# EAGLE design wifistepper (EAGLE 7.6.0)
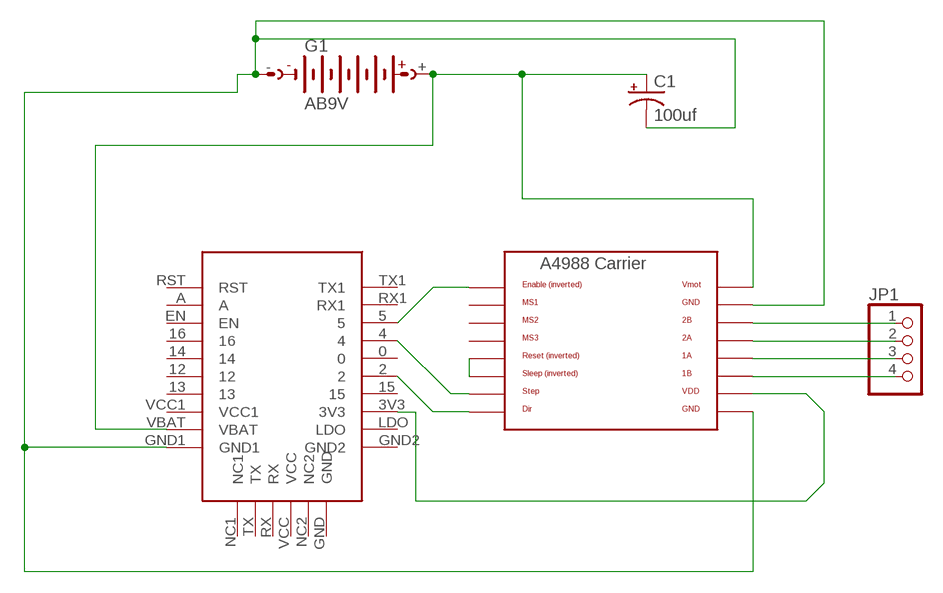
[diagram p0: schematic, sheet 1]

## Parts
C1  100uf  CPOL-USE2.5-6  [E2,5-6]
G1  AB9V  [AB9V]
JP1  PINHD-1X4  [1X04]
U$1  HUZZAH_BREAKOUT_ESP8266THROUGHHOLE  [HUZZAH_BREAKOUT]
U$2  A4988BREAKOUT  [A4988BREAKOUT]

## Nets
N$1: C1.+ G1.+ U$1.VBAT U$2.VMOT
N$2: JP1.1 U$2.2B
N$3: C1.- G1.- U$1.GND1 U$2.GND U$2.GND@0(GND)
N$4: JP1.2 U$2.2A
N$5: JP1.3 U$2.1A
N$6: JP1.4 U$2.1B
N$8: U$1.3V3 U$2.VDD
N$10: U$2.RST U$2.SLP(SLEEP)
N$11: U$1.5 U$2.EN
N$12: U$1.4 U$2.STEP
N$13: U$1.2 U$2.DIR
Unconnected: U$1.0 U$1.12 U$1.13 U$1.14 U$1.15 U$1.16 U$1.A U$1.EN U$1.GND U$1.GND2 U$1.LDO U$1.NC1 U$1.NC2 U$1.RST U$1.RX U$1.RX1 U$1.TX U$1.TX1 U$1.VCC U$1.VCC1 U$2.MS1 U$2.MS2 U$2.MS3

## Library data of the parts
C1 = adafruit:CPOL-US: POLARIZED CAPACITOR, American symbol
G1 = battery:AB9V: 9-V BATTERY CLIP
JP1 = pinhead:PINHD-1X4: PIN HEADER
U$1 = adafruit:HUZZAH_BREAKOUT_ESP8266: Adafruit HUZZAH ESP8266 Breakout Board
U$2 = RepRapjr:A4988BREAKOUT

## Board
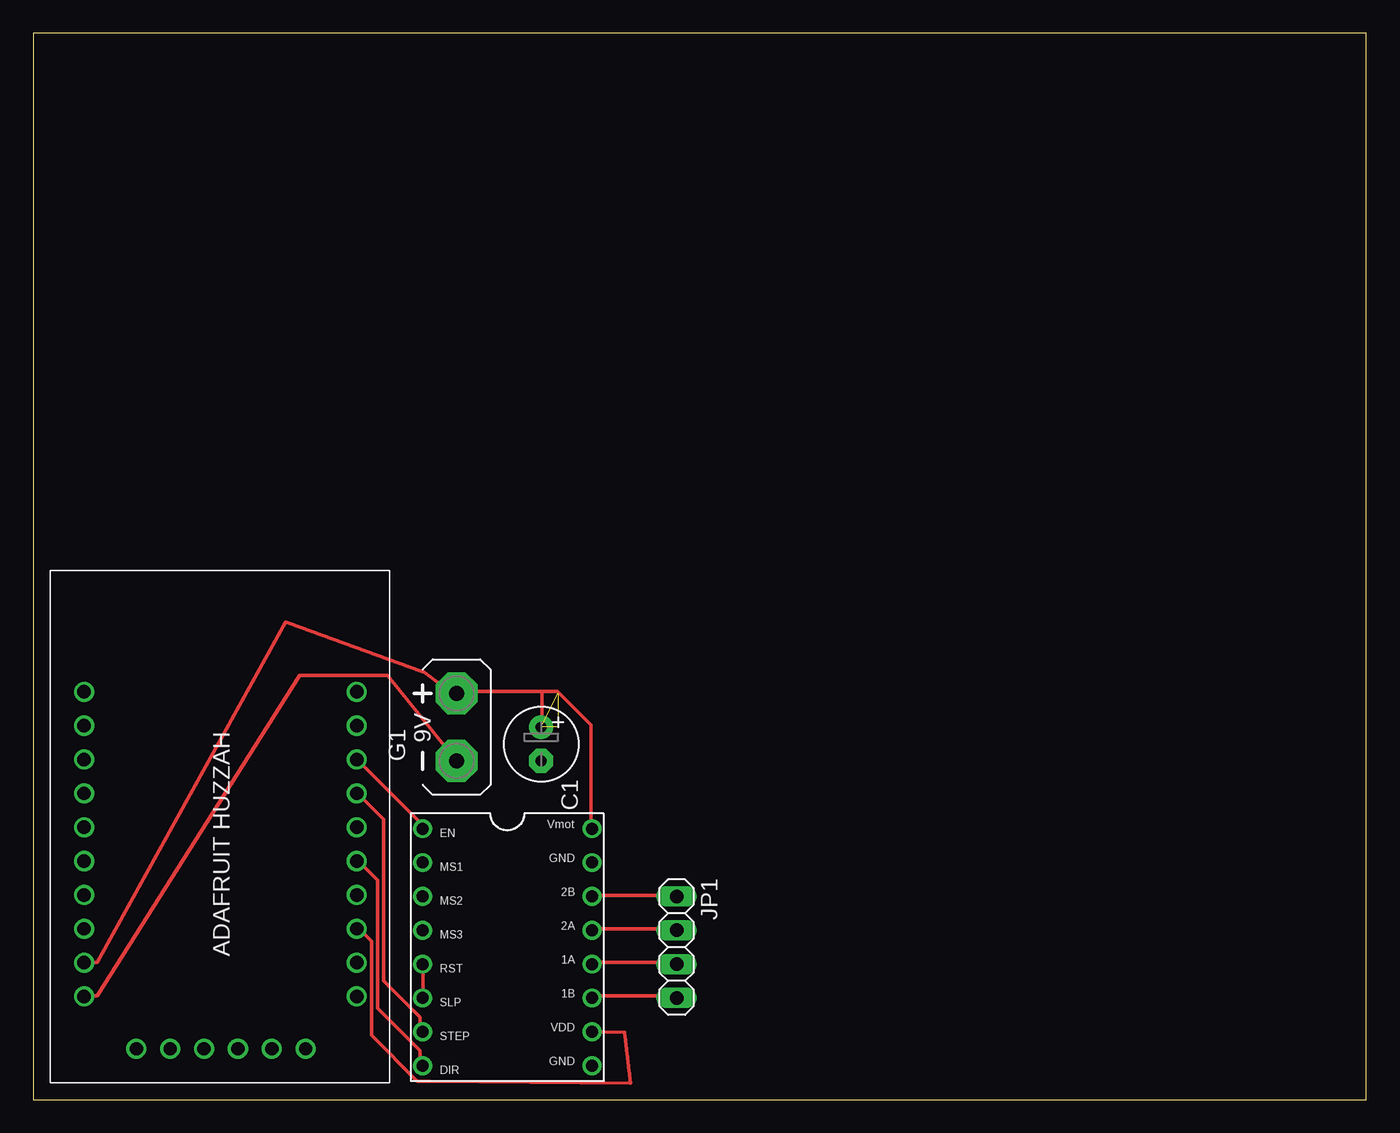
[diagram p1: board, top side]
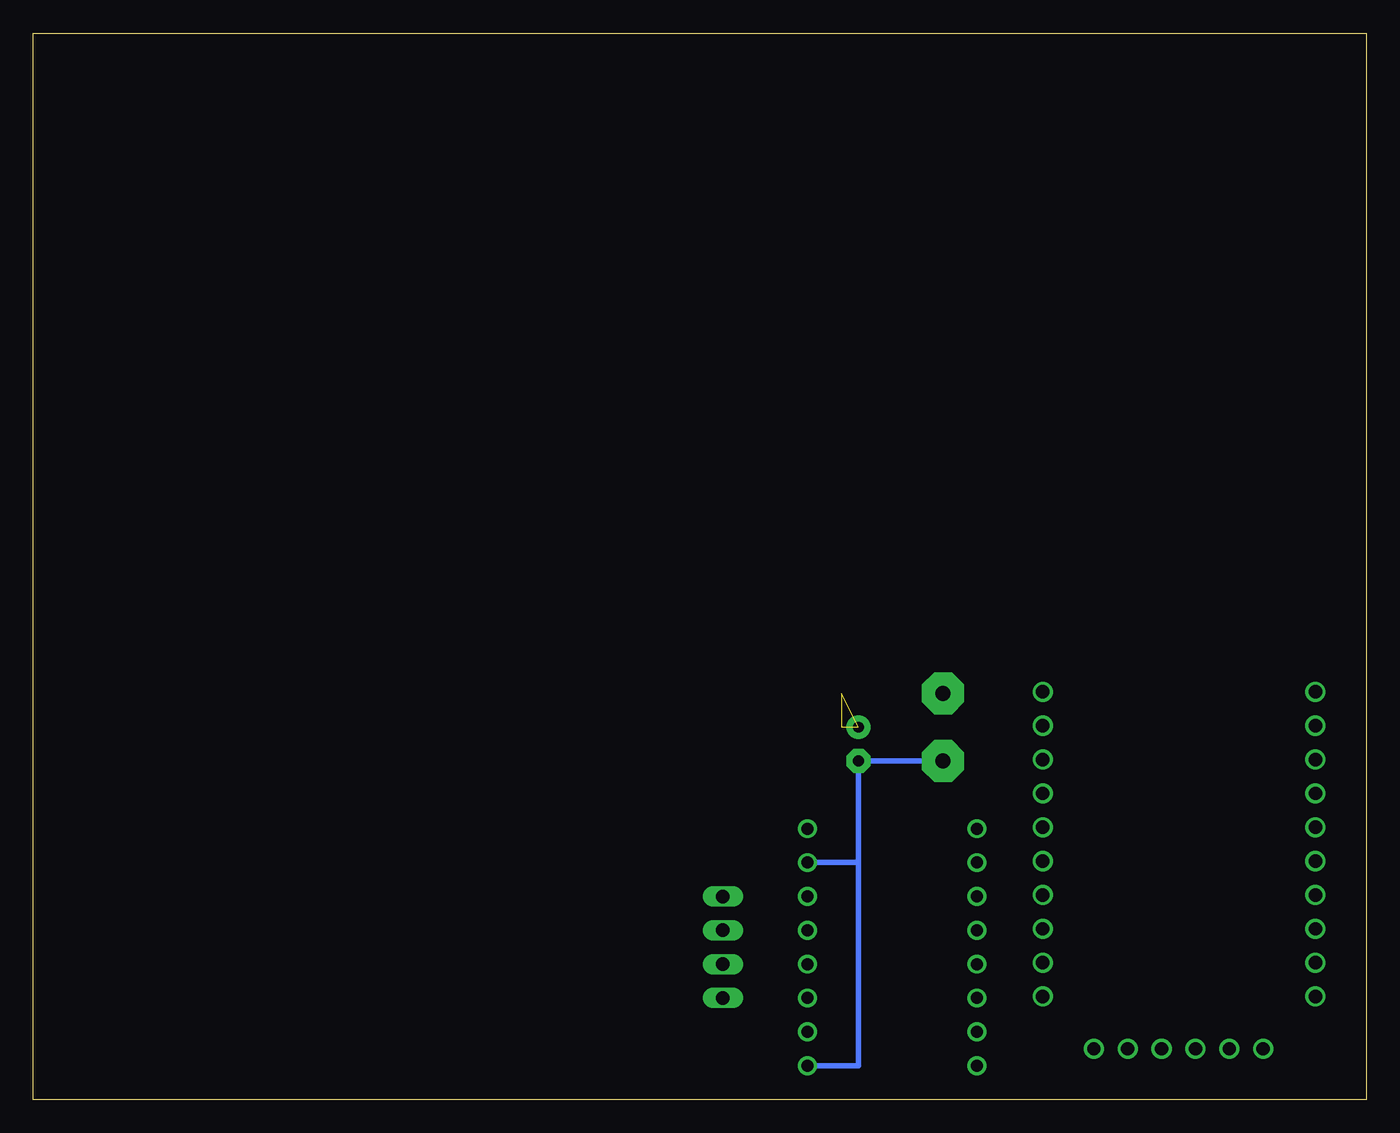
[diagram p2: board, bottom side, seen from below]

Size 100 x 80 mm. Coordinates in mm from the lower left corner, seen from the top.
Outline: 0,0 100,0 100,80 0,80 0,0
Copper layers (1*16): Top 0.035mm / dielectric 1.5mm / Bottom 0.035mm
Design rules "default": minimum track width 10mil, minimum drill 24mil, track to track 8mil, track to pad 8mil, pad to pad 8mil, via to via 8mil, smd to smd 8mil, copper to edge 40mil, drill to drill 8mil, minimum pad ring 10mil, minimum via ring 8mil, stop-mask expansion 4mil, vias tented up to drill 0mil, thermal gap 10mil

### Footprints (pad centres in the part's own frame; a part is rotated, then mirrored left to right if it is on the bottom)
E2,5-6 = drill 0.813 pad 1.778: + -1.27,0 | drill 0.813 pad 1.778 octagon: - 1.27,0
AB9V = drill 1.118 pad 3.15 octagon: + 0,2.54; - 0,-2.54
1X04 = drill 1.016 long: 1 -3.81,0; 2 -1.27,0; 3 1.27,0; 4 3.81,0
HUZZAH_BREAKOUT = drill 1: 0 23,19.16; 2 23,16.62; 3V3 23,11.54; 4 23,21.7; 5 23,24.24; 12 2.54,16.62; 13 2.54,14.08; 14 2.54,19.16; 15 23,14.08; 16 2.54,21.7; A 2.54,26.78; EN 2.54,24.24; GND 19.16,2.54; GND1 2.54,6.46; GND2 23,6.46; LDO 23,9; NC1 6.46,2.54; NC2 16.62,2.54; RST 2.54,29.32; RX 11.54,2.54; RX1 23,26.78; TX 9,2.54; TX1 23,29.32; VBAT 2.54,9; VCC 14.08,2.54; VCC1 2.54,11.54
A4988BREAKOUT = drill 0.9: 1A 8.89,1.27; 1B 11.43,1.27; 2A 6.35,1.27; 2B 3.81,1.27; DIR 16.51,-11.43; EN -1.27,-11.43; GND 16.51,1.27; GND@0 1.27,1.27; MS1 1.27,-11.43; MS2 3.81,-11.43; MS3 6.35,-11.43; RST 8.89,-11.43; SLP 11.43,-11.43; STEP 13.97,-11.43; VDD 13.97,1.27; VMOT -1.27,1.27

### Placement (x,y rotation side)
C1  38.1,26.67 270 top
G1  31.75,27.94 0 top
JP1  48.26,11.43 270 top
U$1  1.27,1.27 0 top
U$2  40.64,19.05 270 top

### Tracks (layer width: path | path; a pad name or v marks a point on that pad's centre or on a via)
N$1  (3 unrouted)
  Top 0.254: U$2.VMOT 41.83,20.34 41.83,28.12 39.32,30.63 38.18,30.63 | U$1.VBAT 3.89,10.29 4.8,10.29 18.92,35.84 29.36,32.03 31.55,30.4 G1.+ 31.77,30.63 38.18,30.63 | 38.18,30.63 38.18,28.12 C1.+
N$2
  Top 0.254: U$2.2B 42.06,15.32 48.23,15.32 JP1.1
N$3
  Top 0.254: 42.06,17.83 U$2.GND@0 | G1.- 26.59,31.83 19.96,31.83 4.8,7.77 3.89,7.77 U$1.GND1
  Bottom 0.406: G1.- C1.- 38.1,17.78 | 38.1,17.78 38.1,2.54 U$2.GND | 38.1,17.78 U$2.GND@0
N$4
  Top 0.254: U$2.2A 42.06,12.8 48.23,12.8 JP1.2
N$5
  Top 0.254: U$2.1A 42.06,10.29 48.23,10.29 JP1.3
N$6
  Top 0.254: U$2.1B 42.06,7.77 48.23,7.77 JP1.4
N$8
  Top 0.254: U$2.VDD 44.37,5.03 44.81,1.22 29.72,1.37 28.8,1.37 25.38,4.8 25.38,11.89 24.46,12.8 U$1.3V3
N$10
  Top 0.254: U$2.SLP 29.26,7.77 29.26,10.06 U$2.RST
N$11
  Top 0.254: U$2.EN 29.03,20.34 29.03,20.8 24.46,25.38 U$1.5
N$12
  Top 0.254: U$2.STEP 29.03,5.26 29.03,6.17 26.29,8.91 26.29,21.03 24.46,22.86 U$1.4
N$13
  Top 0.254: U$2.DIR 29.03,2.74 29.03,3.66 25.83,6.86 25.83,16.46 24.46,17.83 U$1.2